# EAGLE design bicyclelab-charger-protection-2 (EAGLE 6.2)
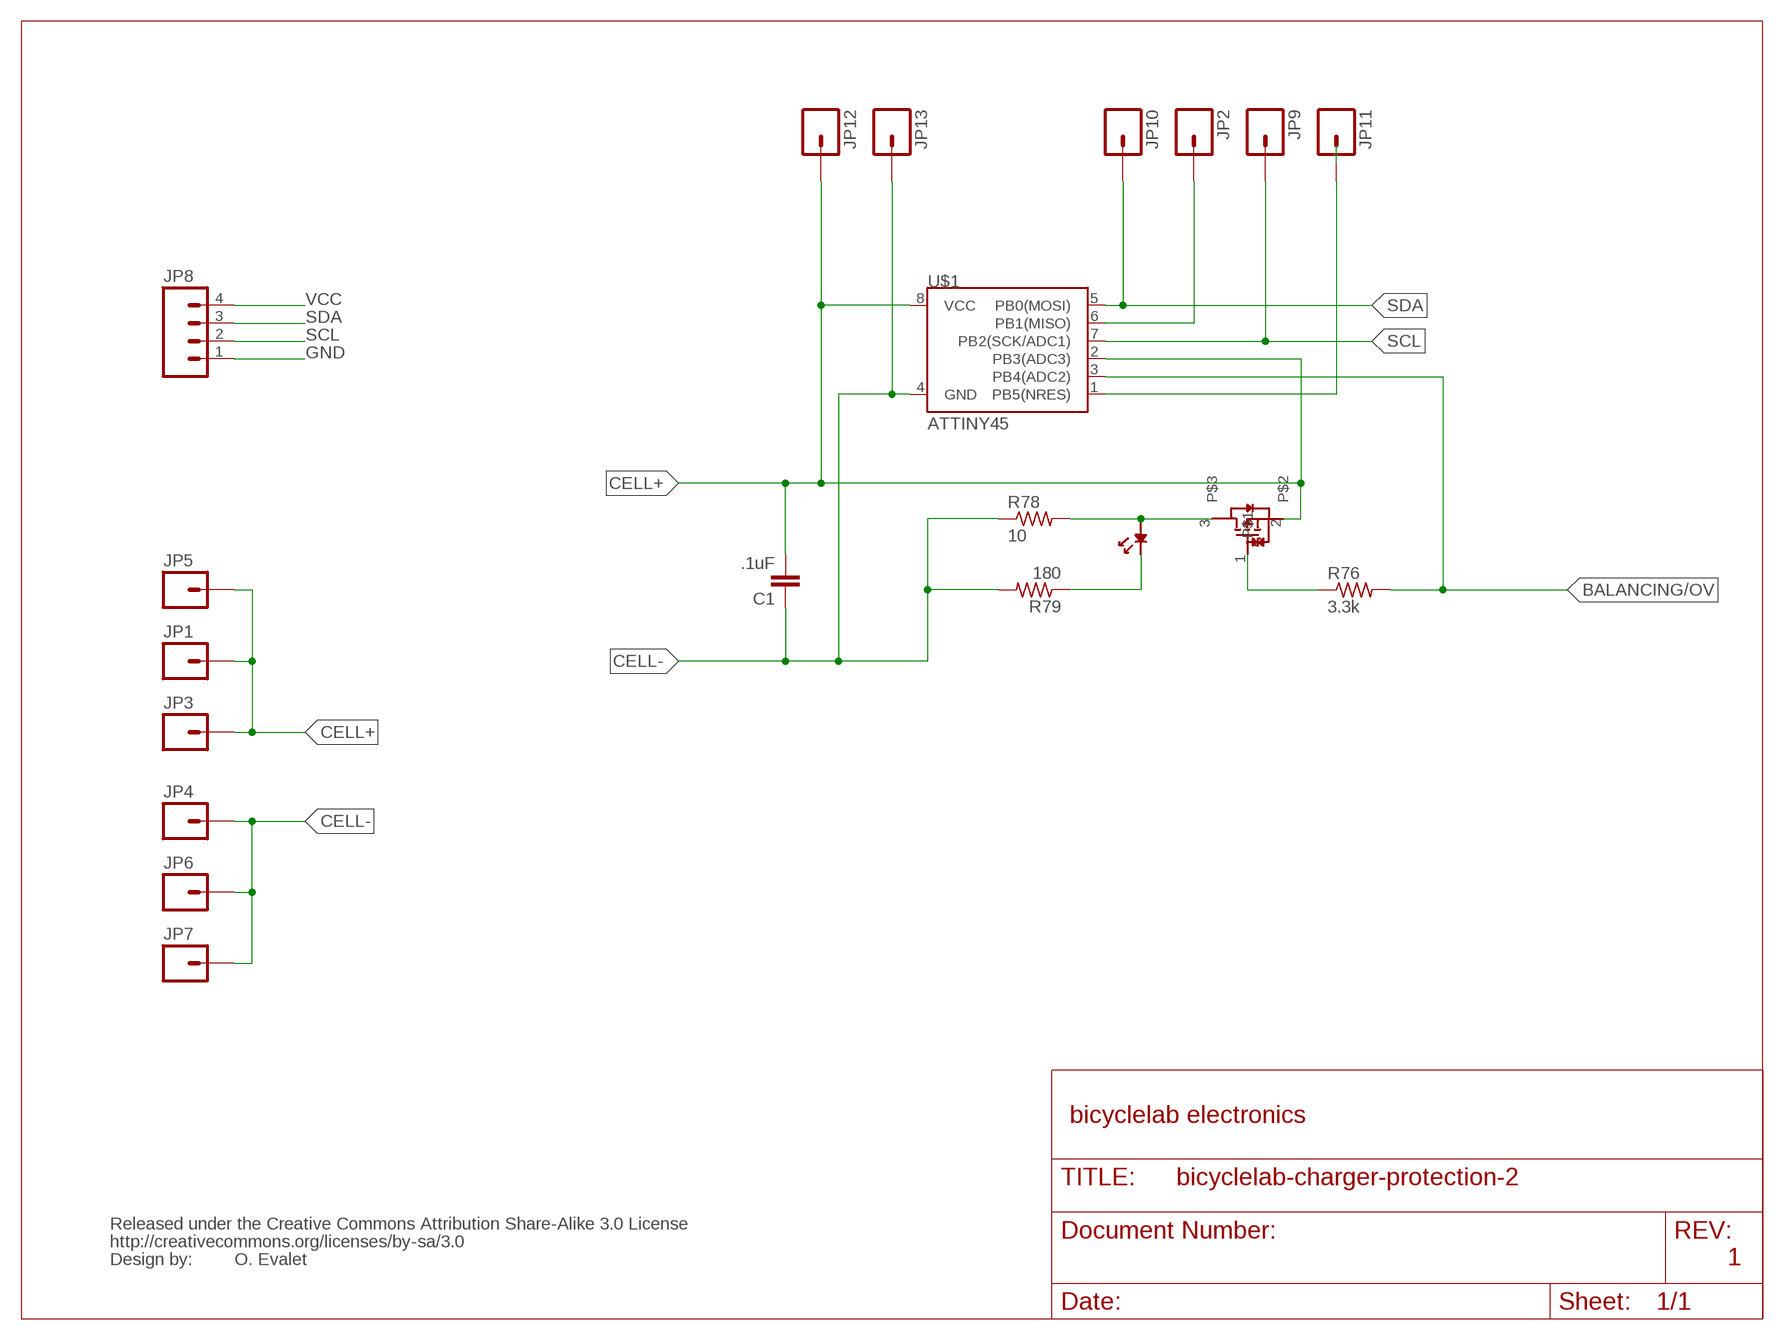
[diagram p0: schematic, sheet 1]

## Parts
C1  .1uF  C-EUC0402  [C0402]
JP1  M01SMD-4.5X1.5  [PAD-1.5X4.5]
JP2  M01SMD-TINY  [PAD-SMD]
JP3  M01SMD-4.5X1.5  [PAD-1.5X4.5]
JP4  M01SMD-4.5X1.5  [PAD-1.5X4.5]
JP5  M01SMD-4.5X1.5  [PAD-1.5X4.5]
JP6  M01SMD-4.5X1.5  [PAD-1.5X4.5]
JP7  M01SMD-4.5X1.5  [PAD-1.5X4.5]
JP8  M04PTH  [1X04]
JP9  M01SMD-TINY  [PAD-SMD]
JP10  M01SMD-TINY  [PAD-SMD]
JP11  M01SMD-TINY  [PAD-SMD]
JP12  M01SMD-TINY  [PAD-SMD]
JP13  M01SMD-TINY  [PAD-SMD]
LED12  LED-0805  [0805]
R76  3.3k  R-US_R0805  [R0805]
R78  10  R-US_R2512  [R2512]
R79  180  R-US_R0805  [R0805]
T12  RTR020P02  [TSMT3]
U$1  ATTINY45  [SO08-EIAJ]
U$5  CREATIVE_COMMONS  [CREATIVE_COMMONS]

## Nets
BALANCING/OV: R76.2 U$1.3(PB4(ADC2))
CELL+: C1.2 JP1.P$1 JP3.P$1 JP5.P$1 JP12.P$1 T12.2 U$1.2(PB3(ADC3)) U$1.8(VCC)
CELL-: C1.1 JP4.P$1 JP6.P$1 JP7.P$1 JP13.P$1 R78.1 R79.2 U$1.4(GND)
GND: JP8.1
N$1: JP2.P$1 U$1.6(PB1(MISO))
N$3: JP11.P$1 U$1.1(PB5(NRES))
N$81: LED12.P$2 R78.2 T12.3
N$82: LED12.P$1 R79.1
N$83: R76.1 T12.1
SCL: JP8.2 JP9.P$1 U$1.7(PB2(SCK/ADC1))
SDA: JP8.3 JP10.P$1 U$1.5(PB0(MOSI))
VCC: JP8.4

## Notes on the sheet
- bicyclelab electronics
- O. Evalet | 1

## Library data of the parts
C1 = rcl:C-EU: CAPACITOR, European symbol
JP1 JP3-JP7 = 0-SparkFun:M01: Header 1 Standard 1-pin 0.1" header. Use with straight break away headers (SKU : PRT-00116), right angle break away headers (PRT-00553), swiss pins (PRT-00743), machine pins (PRT-00117), and female headers (PRT-00115).
JP2 JP9-JP13 = bicyclelab:M01: Header 1 Standard 1-pin 0.1" header. Use with straight break away headers (SKU : PRT-00116), right angle break away headers (PRT-00553), swiss pins (PRT-00743), machine pins (PRT-00117), and female headers (PRT-00115).
JP8 = 0-SparkFun:M04: Header 4 Standard 4-pin 0.1" header. Use with straight break away headers (SKU : PRT-00116), right angle break away headers (PRT-00553), swiss pins (PRT-00743), machine pins (PRT-00117), and female headers (PRT-00115). Molex polarized connector foot print use with SKU : PRT-08231 with associated crimp pins and housings. 1MM SMD Version SKU: PRT-10208
LED12 = BMS:LED-0805: Green 2V 20mA SMT diode
R76 R78 R79 = rcl:R-US_: RESISTOR, American symbol
T12 = BMS:RTR020P02
U$1 = 0-SparkFun:ATTINY45: Atmel ATTiny45
U$5 = SparkFun:CREATIVE_COMMONS

## Net classes
0 default: width 0.203 mm
1 power: width 0.508 mm

## Board
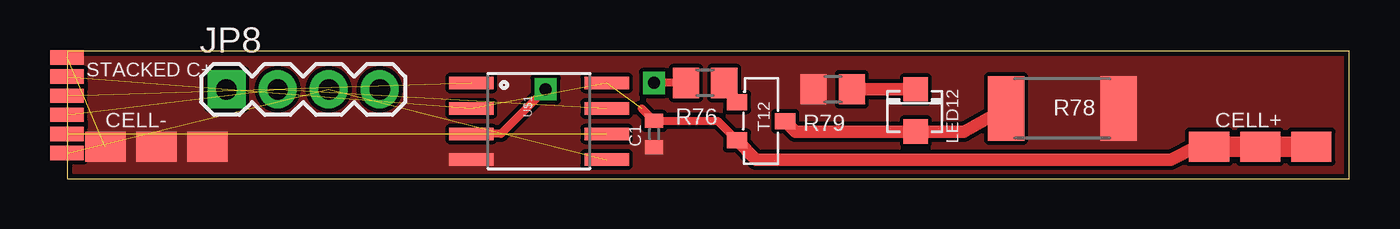
[diagram p1: board, top side]
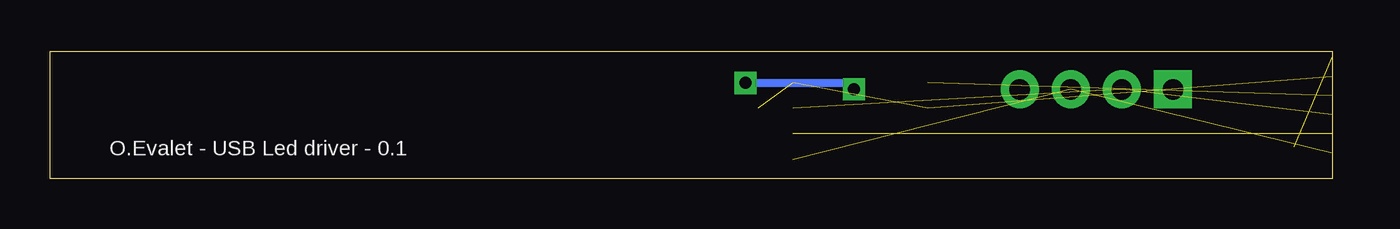
[diagram p2: board, bottom side, seen from below]

Size 63.8 x 6.34 mm. Coordinates in mm from the lower left corner, seen from the top.
Outline: 0,0 63.8,0 63.8,6.34 0,6.34 0,0
Copper layers (1*16): Top 0.035mm / dielectric 1.5mm / Bottom 0.035mm
Design rules: minimum track width 8mil, minimum drill 20mil, track to track 8mil, track to pad 8mil, pad to pad 8mil, via to via 8mil, smd to smd 8mil, copper to edge 10mil, drill to drill 8mil, minimum pad ring 12mil, minimum via ring 10mil, stop-mask expansion 4mil, vias tented up to drill 25mil, thermal gap 10mil

### Footprints (pad centres in the part's own frame; a part is rotated, then mirrored left to right if it is on the bottom)
C0402 = smd 0.7 x 0.9: 1 -0.65,0; 2 0.65,0
PAD-1.5X4.5 = smd 1.5 x 2: P$1 0,0
PAD-SMD = smd 1.676 x 0.711: P$1 0,0
1X04 = drill 1.016 pad 1.88 square: 1 0,0 | drill 1.016 pad 1.88: 2 2.54,0; 3 5.08,0; 4 7.62,0
0805 = smd 1.2 x 1.2: P$1 0,0; P$2 2.1,0
R0805 = smd 1.3 x 1.5: 1 -0.95,0; 2 0.95,0
R2512 = smd 1.8 x 3.2: 1 -2.8,0; 2 2.8,0
TSMT3 = smd 0.8 x 1: 1 -0.95,0; 2 0.95,0; 3 0,2.4
SO08-EIAJ = smd 0.61 x 2.21: 1 -1.905,-3.378; 2 -0.635,-3.378; 3 0.635,-3.378; 4 1.905,-3.378; 5 1.905,3.353; 6 0.635,3.353; 7 -0.635,3.353; 8 -1.905,3.353

### Placement (x,y rotation side)
C1  29.21,2.22 90 top
JP1  59.37,1.59 90 top
JP2  0,2.22 0 top
JP3  56.83,1.59 90 top
JP4  1.91,1.59 90 top
JP5  61.91,1.59 90 top
JP6  4.45,1.59 90 top
JP7  6.99,1.59 90 top
JP8  7.94,4.45 0 top
JP9  0,3.17 0 top
JP10  0,1.27 0 top
JP11  0,4.13 0 top
JP12  0,5.08 0 top
JP13  0,6.03 0 top
LED12  42.23,4.45 270 top
R76  31.75,4.76 180 top
R78  49.53,3.49 180 top
R79  38.1,4.45 180 top
T12  33.34,2.86 270 top
U$1  23.5,2.86 270 top
U$5  3.49,-10.48 0 top  (outside the outline)

### Tracks (layer width: path | path; a pad name or v marks a point on that pad's centre or on a via)
BALANCING/OV  (via drill 0.6)
  Top 0.406: R76.2 v29.21,4.76 | v23.81,4.45 21.59,2.22 U$1.3
  Bottom 0.406: v29.21,4.76 24.13,4.76 v23.81,4.45
CELL+  (3 unrouted)
  Top 0.406: 28.59,3.49 C1.2 32.37,2.87 T12.2
  Top 0.61: T12.2 34.29,0.95 54.93,0.95 56.2,1.59 JP3.P$1
  Top 1.016: JP3.P$1 JP1.P$1 JP5.P$1
CELL-  (1 unrouted)
  pour Top (rank 4, no thermals): 0,6.35 63.82,6.35 63.82,0 0,0
N$1  (1 unrouted)
N$3  (1 unrouted)
N$81
  Top 0.61: R78.2 44.63,2.35 LED12.P$2 36.25,2.35 T12.3
N$82
  Top 0.61: LED12.P$1 R79.1
N$83
  Top 0.406: R76.1 32.4,4.75 T12.1
SCL  (2 unrouted)
SDA  (2 unrouted)

### Text on the board
tPlace: C- | CB | C+ | STACKED C+ | CELL- | CELL+
bPlace: O.Evalet - USB Led driver - 0.1
tValues: O.Evalet